# Altium schematic sheet Gain Scaling.SchDoc
size 406 x 304 mm; SheetNumber: 7; SheetTotal: 8
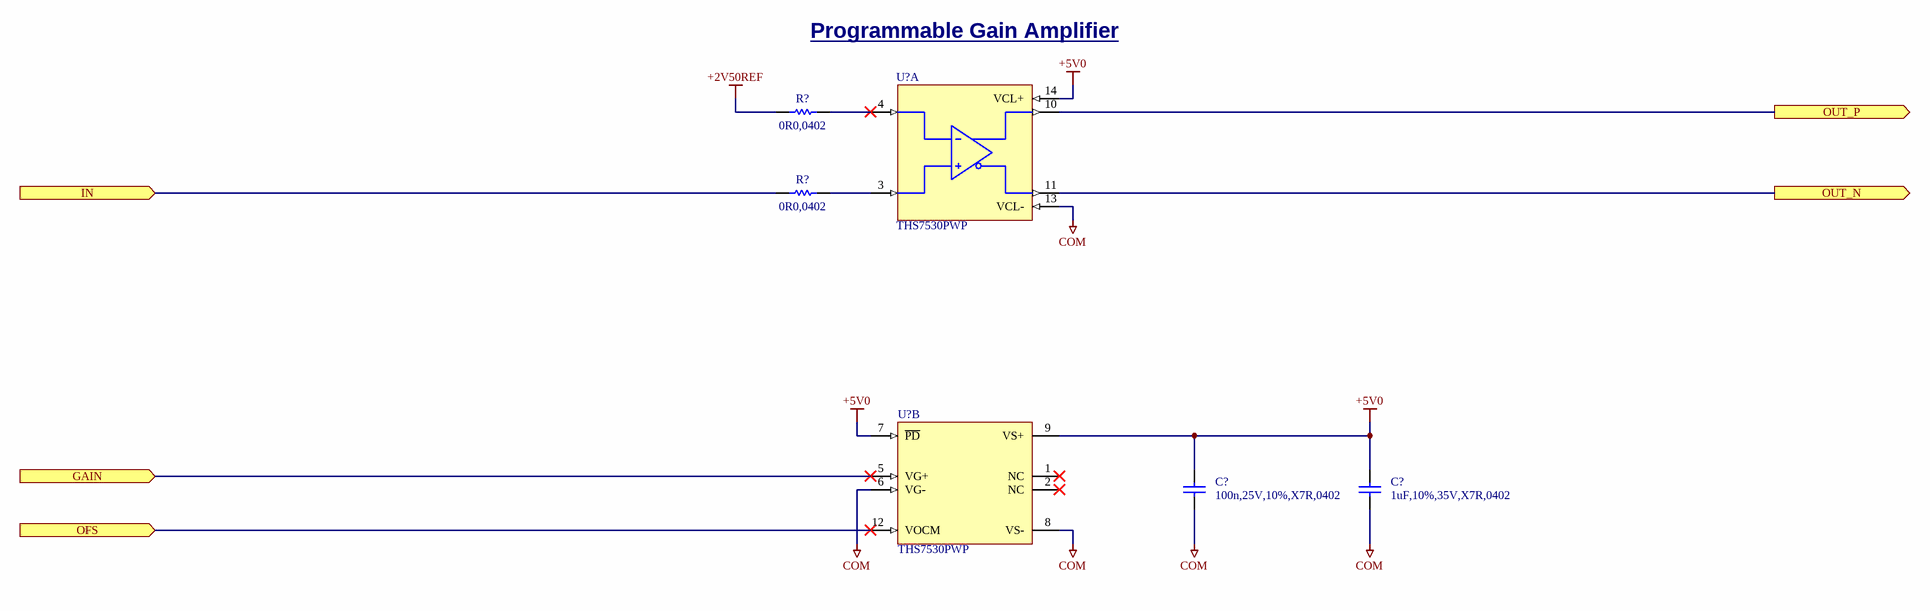
[diagram p0: Gain Scaling.SchDoc]

## Parts
(Parts that share a designator on the sheet are numbered #1, #2 ... from top to bottom, then left to right.)
C?#1  100n,25V,10%,X7R,0402  [CAPC1005X06N]
C?#2  1uF,10%,35V,X7R,0402  [CAPC1005X06N]
R?#1  0R0,0402  [RESC1005X04N]
R?#2  0R0,0402  [RESC1005X04N]
U?#1  THS7530PWP  [TEXASINSTRUMENTS_PKG_PWP0014J]  (part A of 2)
U?#2  THS7530PWP  [TEXASINSTRUMENTS_PKG_PWP0014J]  (part B of 2)

## Ports
GAIN (in), IN (in), OFS (in), OUT_N (out), OUT_P (out)

## Nets
+2V50REF: R?#1.1
+5V0: C?#1.2 C?#2.2 U?#1.14(VCL+) U?#2.7(~{PD}) U?#2.9(VS+)
COM: C?#1.1 C?#2.1 U?#1.13(VCL-) U?#2.6(VG-) U?#2.8(VS-)
GAIN: U?#2.5(VG+) ; port GAIN
IN: R?#2.1 ; port IN
OFS: U?#2.12(VOCM) ; port OFS
OUT_N: U?#1.11(VOUT-) ; port OUT_N
OUT_P: U?#1.10(VOUT+) ; port OUT_P
NetR?#1_2: R?#1.2 U?#1.4(VIN-)
NetR?#2_2: R?#2.2 U?#1.3(VIN+)

Not connected (* = marked no-connect by the designer): U?#2 1(NC)* 2(NC)*

## Notes on the sheet
- Programmable Gain Amplifier
- Sheet Name:
- Date:
- Sheet
- Designer:
- of

## Library data of the parts
C?#1 = CAP,Cer,100nF,10%,25VDC,X7R,0402: 0.1ï¿½F ï¿½10% 25V Ceramic Capacitor X7R 0402 (1005 Metric); Manufacturer 1: Murata Electronics; Manufacturer 1 Part Number: GRM155R71E104KE14J; Vendor 1 Part Number: 490-14603-1-ND; Vendor 1: DigiKey; Value: 100nF; Part Name: CAP,Cer,100nF,10%,25VDC,X7R,0402; CreatedBy: Judd Foster; HelpURL: https://search.murata.co.jp/Ceramy/image/img/A01X/G101/ENG/GRM155R71E104KE14-01.pdf
C?#2 = CAP,Cer,1uF,35VDC,X5R,0402: 1 ï¿½F ï¿½10% 35V Ceramic Capacitor X5R 0402 (1005 Metric); Manufacturer 1: TDK Corporation; Manufacturer 1 Part Number: C1005X5R1V105K050BC; Vendor 1 Part Number: 445-9073-1-ND; Vendor 1: Digikey; Value: 1u; Part Name: CAP,Cer,1uF,35VDC,X5R,0402; CreatedBy: Judd Foster; HelpURL: https://product.tdk.com/info/en/catalog/datasheets/mlcc_commercial_general_en.pdf?ref_disty=digikey
R?#1 R?#2 = RES,0R0,0402: 0 Ohms Jumper 0.1W, 1/10W Chip Resistor 0402 (1005 Metric) Automotive AEC-Q200 Thick Film; Manufacturer 1: Panasonic Electronic Components; Manufacturer 1 Part Number: ERJ-2GE0R00X; Vendor 1 Part Number: P0.0JCT-ND; Vendor 1: Digikey; Value: 0R; Part Name: RES,0R0,0402; CreatedBy: Judd Foster; HelpURL: https://industrial.panasonic.com/cdbs/www-data/pdf/RDA0000/AOA0000C301.pdf
U?#1 U?#2 = THS7530PWP: Variable Gain Amplifier 1 Circuit Differential 14-HTSSOP; Manufacturer 1: Texas Instruments; Vendor 1 Part Number: 296-15181-5-ND; Vendor 1: DigiKey; Part Name: THS7530PWP; CreatedBy: Judd Foster; HelpURL: https://www.ti.com/lit/ds/symlink/ths7530-q1.pdf?ts=1736214928306&ref_url=https%253A%252F%252Fwww.ti.com%252Famplifier-circuit%252Fpga-vga%252Fproducts.html; Manufacturer 1 Part Number: THS7530PWP